# Altium schematic sheet MCU_POWER.SchDoc
size A4
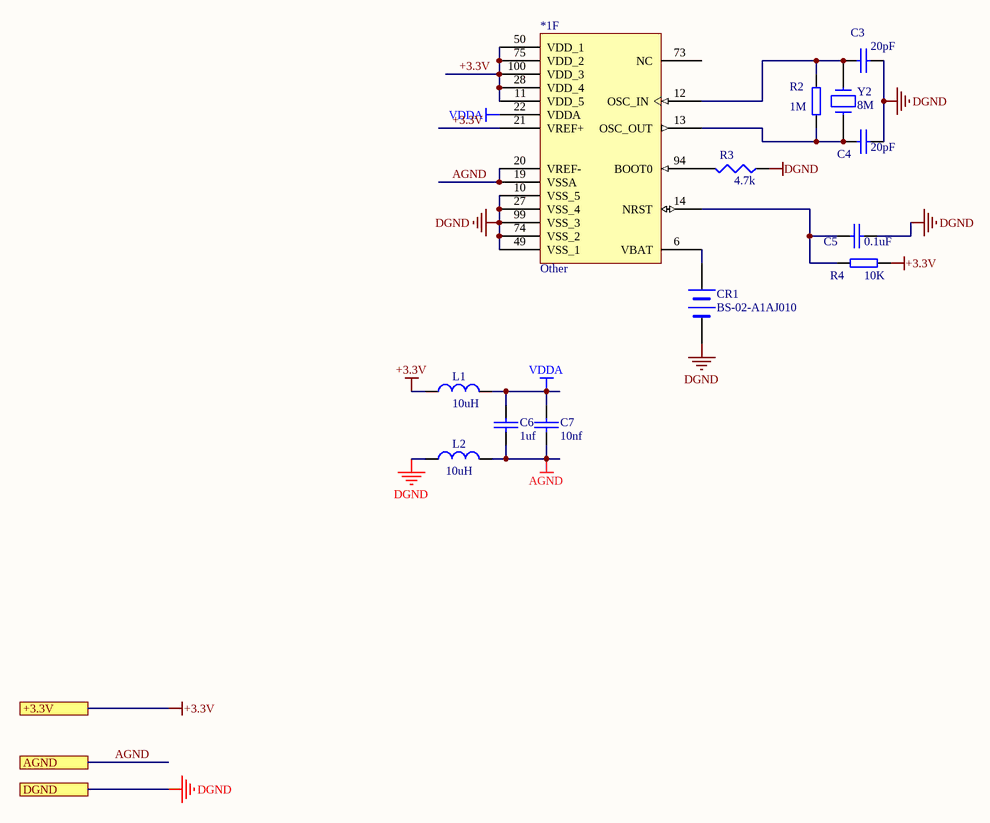
[diagram p0: MCU_POWER.SchDoc]

## Parts
*1  Other  [STM-LQFP100_N]  (part F of 6)
C3  20pF  [0805C]
C4  20pF  [0805C]
C5  0.1uF  [0805C]
C6  1uf  [0805C]
C7  10nf  [0805C]
CR1  BS-02-A1AJ010  [BATT]
L1  10uH  [L 0805]
L2  10uH  [L 0805]
R2  1M  [0805R]
R3  4.7k  [0805R]
R4  10K  [0805R]
Y2  8M  [XTAL3]

## Ports
+3.3V, AGND, DGND

## Nets
+3.3V: *1.11(VDD_5) *1.21(VREF+) *1.28(VDD_4) *1.50(VDD_1) *1.75(VDD_2) *1.100(VDD_3) L1.1 R4.2 ; port +3.3V
AGND: *1.19(VSSA) *1.20(VREF-) C6.1 C7.2 L2.2 ; port AGND
DGND: *1.10(VSS_5) *1.27(VSS_4) *1.49(VSS_1) *1.74(VSS_2) *1.99(VSS_3) C3.2 C4.2 C5.1 CR1.2(-) L2.1 R3.1 ; port DGND
VDDA: *1.22(VDDA) C6.2 C7.1 L1.2
Net*1_6: *1.6(VBAT) CR1.1(+)
Net*1_12: *1.12(OSC_IN) C3.1 R2.1 Y2.1
Net*1_13: *1.13(OSC_OUT) C4.1 R2.2 Y2.2
Net*1_14: *1.14(NRST) C5.2 R4.1
Net*1_94: *1.94(BOOT0) R3.2

Not connected (* = marked no-connect by the designer): *1 73(NC)

## Library data of the parts
*1 = stm32f103vct6
C3 C4 = CAP_3: 品牌： SAMSUNG(三星)  型号： CL21C200JBANNNC     容值：20pF 精度：±5% 额定电压：50V 材质(温度系数)：C0G 材质:C0G
C5 = CAP_3: 品牌： SAMSUNG(三星)    型号： CL10B104KB8NNNC  容值：100nF 精度：±10% 额定电压：50V 材质(温度系数)：X7R 材质:X7R
C6 = CAP_3: 品牌： SAMSUNG(三星)  型号： CL21B105KBFNNNE  容值：1uF 精度：±10% 额定电压：50V 材质(温度系数)：X7R 材质:X7R
C7 = CAP_3: 品牌： SAMSUNG(三星)  型号： CL21B103KBANNNC  容值：10nF 精度：±10% 额定电压：50V 材质(温度系数)：X7R 材质:X7R
CR1 = BATTERY: 品牌： MYOUNG(美阳)  型号： BS-02-A1AJ010  连接器类型：电池底座 适用电池规格：CR2032 工作温度范围：-25℃~+85℃ 插脚 卧式底座 环保吸塑托盘包装
L1 L2 = INDUCTOR: 品牌： FH(风华)  型号： CMI201209X100KT  ：电感值：10uH 精度：±10% 额定电流：15mA 直流电阻(DCR)：1.15Ω
R2 = RES4: 品牌： UNI-ROYAL(厚声)  型号： 0805W8F1004T5E  电阻类型：厚膜电阻 阻值：1MΩ 精度：±1% 功率：125mW 温度系数：±100ppm/℃
R3 = RES1: 品牌： UNI-ROYAL(厚声)  品牌： UNI-ROYAL(厚声)  电阻类型：厚膜电阻 阻值：100kΩ 精度：±1% 功率：125mW 温度系数：±100ppm/℃
R4 = RES4: 品牌： UNI-ROYAL(厚声) 型号： 0805W8F1002T5E 电阻类型：厚膜电阻 阻值：10kΩ 精度：±1% 功率：125mW 温度系数：±100ppm/℃
Y2 = XTAL-1: 品牌： YXC(扬兴晶振)  型号： X49SD8MSD2SC   频率：8MHz 频率公差：±20ppm 负载电容：20pF 频率： 8MHz 负载： 20pF 频率公差： ±20ppm 工作温度： -20~70℃